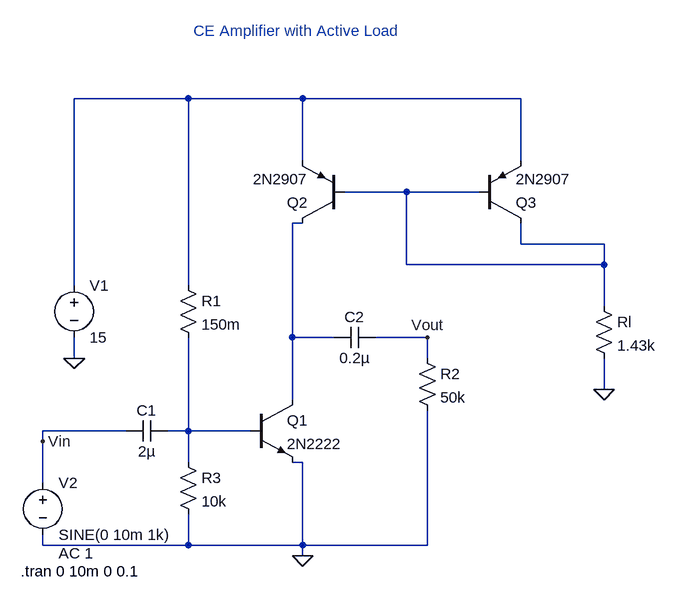
[diagram p0: schematic Experiment 11 - CE Amplifier with Active Load using BJT.asc]
Experiment 11 - CE Amplifier with Active Load using BJT.asc, the LTspice schematic file:
Version 4
SHEET 1 888 680
WIRE 160 -192 -16 -192
WIRE 336 -192 160 -192
WIRE 672 -192 336 -192
WIRE 336 -96 336 -192
WIRE 672 -96 672 -192
WIRE 496 -48 400 -48
WIRE 608 -48 496 -48
WIRE 336 0 320 0
WIRE 672 32 672 0
WIRE 800 32 672 32
WIRE 496 64 496 -48
WIRE 800 64 800 32
WIRE 800 64 496 64
WIRE -16 96 -16 -192
WIRE 160 96 160 -192
WIRE 800 128 800 64
WIRE 320 176 320 0
WIRE 384 176 320 176
WIRE 528 176 448 176
WIRE -16 208 -16 176
WIRE 528 208 528 176
WIRE 800 256 800 208
WIRE 320 272 320 176
WIRE 64 320 -64 320
WIRE 160 320 160 176
WIRE 160 320 128 320
WIRE 256 320 160 320
WIRE -64 336 -64 320
WIRE 160 368 160 320
WIRE 336 368 320 368
WIRE -64 400 -64 336
WIRE -64 496 -64 480
WIRE 160 496 160 448
WIRE 160 496 -64 496
WIRE 336 496 336 368
WIRE 336 496 160 496
WIRE 528 496 528 288
WIRE 528 496 336 496
WIRE 336 512 336 496
FLAG -16 208 0
FLAG 336 512 0
FLAG 800 256 0
FLAG 528 176 Vout
FLAG -64 336 Vin
SYMBOL voltage -16 80 R0
WINDOW 123 0 0 Left 0
WINDOW 39 0 0 Left 0
SYMATTR InstName V1
SYMATTR Value 15
SYMBOL res 144 80 R0
SYMATTR InstName R1
SYMATTR Value 150m
SYMBOL pnp 400 0 R180
SYMATTR InstName Q2
SYMATTR Value 2N2907
SYMBOL pnp 608 0 M180
SYMATTR InstName Q3
SYMATTR Value 2N2907
SYMBOL res 512 192 R0
SYMATTR InstName R2
SYMATTR Value 50k
SYMBOL npn 256 272 R0
SYMATTR InstName Q1
SYMATTR Value 2N2222
SYMBOL voltage -64 384 R0
WINDOW 123 24 124 Left 2
WINDOW 39 0 0 Left 0
SYMATTR InstName V2
SYMATTR Value SINE(0 10m 1k)
SYMATTR Value2 AC 1
SYMBOL cap 128 304 R90
WINDOW 0 0 32 VBottom 2
WINDOW 3 32 32 VTop 2
SYMATTR InstName C1
SYMATTR Value 2µ
SYMBOL res 784 112 R0
SYMATTR InstName Rl
SYMATTR Value 1.43k
SYMBOL cap 448 160 R90
WINDOW 0 0 32 VBottom 2
WINDOW 3 32 32 VTop 2
SYMATTR InstName C2
SYMATTR Value 0.2µ
SYMBOL res 144 352 R0
SYMATTR InstName R3
SYMATTR Value 10k
TEXT -98 536 Left 2 !.tran 0 10m 0 0.1
TEXT 168 -296 Left 2 ;CE Amplifier with Active Load

The netlist it stands for:
* Experiment 11 - CE Amplifier with Active Load using BJT.asc
V1 N001 0 15
R1 N001 N004 150m
Q2 N003 N002 N001 0 2N2907
Q3 N002 N002 N001 0 2N2907
R2 Vout 0 50k
Q1 N003 N004 0 0 2N2222
V2 Vin 0 SINE(0 10m 1k) AC 1
C1 N004 Vin 2µ
Rl N002 0 1.43k
C2 Vout N003 0.2µ
R3 N004 0 10k
.model NPN NPN
.model PNP PNP
.lib standard.bjt
.tran 0 10m 0 0.1
* CE Amplifier with Active Load
.backanno
.end